# Altium schematic sheet WS2812_MATRIX_2.SchDoc
size A4
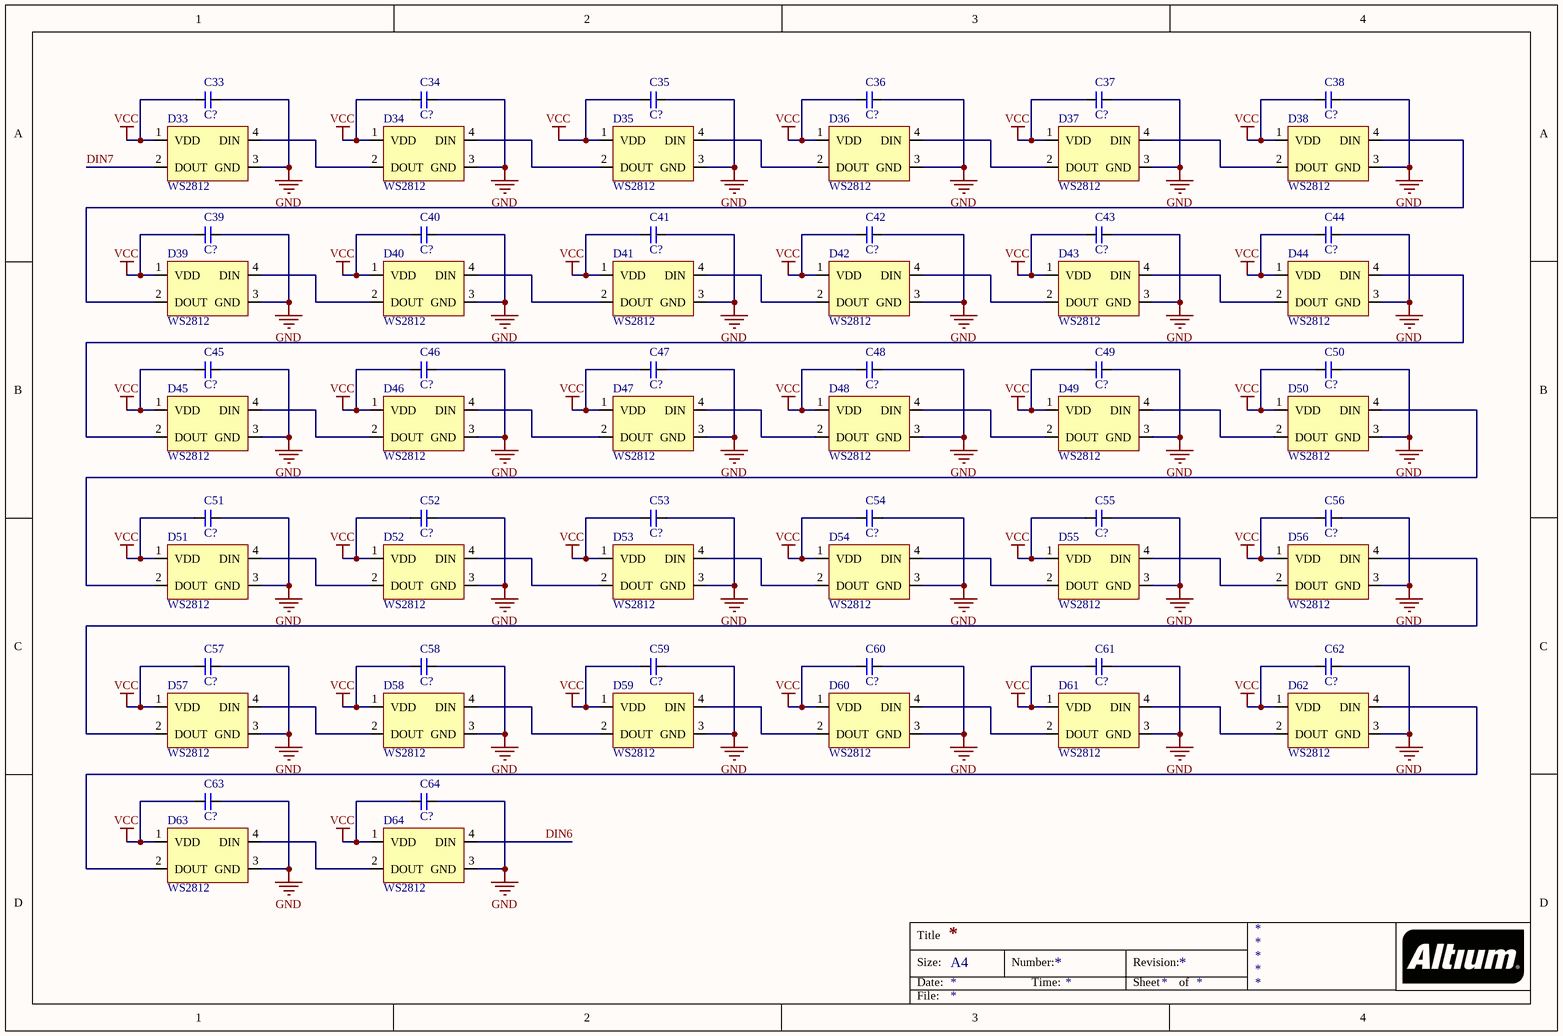
[diagram p0: WS2812_MATRIX_2.SchDoc]

## Parts
C33  C?  [C0603]
C34  C?  [C0603]
C35  C?  [C0603]
C36  C?  [C0603]
C37  C?  [C0603]
C38  C?  [C0603]
C39  C?  [C0603]
C40  C?  [C0603]
C41  C?  [C0603]
C42  C?  [C0603]
C43  C?  [C0603]
C44  C?  [C0603]
C45  C?  [C0603]
C46  C?  [C0603]
C47  C?  [C0603]
C48  C?  [C0603]
C49  C?  [C0603]
C50  C?  [C0603]
C51  C?  [C0603]
C52  C?  [C0603]
C53  C?  [C0603]
C54  C?  [C0603]
C55  C?  [C0603]
C56  C?  [C0603]
C57  C?  [C0603]
C58  C?  [C0603]
C59  C?  [C0603]
C60  C?  [C0603]
C61  C?  [C0603]
C62  C?  [C0603]
C63  C?  [C0603]
C64  C?  [C0603]
D33  WS2812  [WS2812_3528]
D34  WS2812  [WS2812_3528]
D35  WS2812  [WS2812_3528]
D36  WS2812  [WS2812_3528]
D37  WS2812  [WS2812_3528]
D38  WS2812  [WS2812_3528]
D39  WS2812  [WS2812_3528]
D40  WS2812  [WS2812_3528]
D41  WS2812  [WS2812_3528]
D42  WS2812  [WS2812_3528]
D43  WS2812  [WS2812_3528]
D44  WS2812  [WS2812_3528]
D45  WS2812  [WS2812_3528]
D46  WS2812  [WS2812_3528]
D47  WS2812  [WS2812_3528]
D48  WS2812  [WS2812_3528]
D49  WS2812  [WS2812_3528]
D50  WS2812  [WS2812_3528]
D51  WS2812  [WS2812_3528]
D52  WS2812  [WS2812_3528]
D53  WS2812  [WS2812_3528]
D54  WS2812  [WS2812_3528]
D55  WS2812  [WS2812_3528]
D56  WS2812  [WS2812_3528]
D57  WS2812  [WS2812_3528]
D58  WS2812  [WS2812_3528]
D59  WS2812  [WS2812_3528]
D60  WS2812  [WS2812_3528]
D61  WS2812  [WS2812_3528]
D62  WS2812  [WS2812_3528]
D63  WS2812  [WS2812_3528]
D64  WS2812  [WS2812_3528]

## Nets
GND: C33.2 C34.2 C35.2 C36.2 C37.2 C38.2 C39.2 C40.2 C41.2 C42.2 C43.2 C44.2 C45.2 C46.2 C47.2 C48.2 C49.2 C50.2 C51.2 C52.2 C53.2 C54.2 C55.2 C56.2 C57.2 C58.2 C59.2 C60.2 C61.2 C62.2 C63.2 C64.2 D33.3(GND) D34.3(GND) D35.3(GND) D36.3(GND) D37.3(GND) D38.3(GND) D39.3(GND) D40.3(GND) D41.3(GND) D42.3(GND) D43.3(GND) D44.3(GND) D45.3(GND) D46.3(GND) D47.3(GND) D48.3(GND) D49.3(GND) D50.3(GND) D51.3(GND) D52.3(GND) D53.3(GND) D54.3(GND) D55.3(GND) D56.3(GND) D57.3(GND) D58.3(GND) D59.3(GND) D60.3(GND) D61.3(GND) D62.3(GND) D63.3(GND) D64.3(GND)
VCC: C33.1 C34.1 C35.1 C36.1 C37.1 C38.1 C39.1 C40.1 C41.1 C42.1 C43.1 C44.1 C45.1 C46.1 C47.1 C48.1 C49.1 C50.1 C51.1 C52.1 C53.1 C54.1 C55.1 C56.1 C57.1 C58.1 C59.1 C60.1 C61.1 C62.1 C63.1 C64.1 D33.1(VDD) D34.1(VDD) D35.1(VDD) D36.1(VDD) D37.1(VDD) D38.1(VDD) D39.1(VDD) D40.1(VDD) D41.1(VDD) D42.1(VDD) D43.1(VDD) D44.1(VDD) D45.1(VDD) D46.1(VDD) D47.1(VDD) D48.1(VDD) D49.1(VDD) D50.1(VDD) D51.1(VDD) D52.1(VDD) D53.1(VDD) D54.1(VDD) D55.1(VDD) D56.1(VDD) D57.1(VDD) D58.1(VDD) D59.1(VDD) D60.1(VDD) D61.1(VDD) D62.1(VDD) D63.1(VDD) D64.1(VDD)
DIN6: D64.4(DIN)
DIN7: D33.2(DOUT)
NetD33_4: D33.4(DIN) D34.2(DOUT)
NetD34_4: D34.4(DIN) D35.2(DOUT)
NetD35_4: D35.4(DIN) D36.2(DOUT)
NetD36_4: D36.4(DIN) D37.2(DOUT)
NetD37_4: D37.4(DIN) D38.2(DOUT)
NetD38_4: D38.4(DIN) D39.2(DOUT)
NetD39_4: D39.4(DIN) D40.2(DOUT)
NetD40_4: D40.4(DIN) D41.2(DOUT)
NetD41_4: D41.4(DIN) D42.2(DOUT)
NetD42_4: D42.4(DIN) D43.2(DOUT)
NetD43_4: D43.4(DIN) D44.2(DOUT)
NetD44_4: D44.4(DIN) D45.2(DOUT)
NetD45_4: D45.4(DIN) D46.2(DOUT)
NetD46_4: D46.4(DIN) D47.2(DOUT)
NetD47_4: D47.4(DIN) D48.2(DOUT)
NetD48_4: D48.4(DIN) D49.2(DOUT)
NetD49_4: D49.4(DIN) D50.2(DOUT)
NetD50_4: D50.4(DIN) D51.2(DOUT)
NetD51_4: D51.4(DIN) D52.2(DOUT)
NetD52_4: D52.4(DIN) D53.2(DOUT)
NetD53_4: D53.4(DIN) D54.2(DOUT)
NetD54_4: D54.4(DIN) D55.2(DOUT)
NetD55_4: D55.4(DIN) D56.2(DOUT)
NetD56_4: D56.4(DIN) D57.2(DOUT)
NetD57_4: D57.4(DIN) D58.2(DOUT)
NetD58_4: D58.4(DIN) D59.2(DOUT)
NetD59_4: D59.4(DIN) D60.2(DOUT)
NetD60_4: D60.4(DIN) D61.2(DOUT)
NetD61_4: D61.4(DIN) D62.2(DOUT)
NetD62_4: D62.4(DIN) D63.2(DOUT)
NetD63_4: D63.4(DIN) D64.2(DOUT)

## Notes on the sheet
- Title
- Size:
- Date:
- A4
- Number:
- Time:
- Revision:
- Sheet
- of
- File:

## Library data of the parts
C33-C64 = CAP